# Altium schematic sheet Clock.SchDoc
size 420 x 297 mm; SheetNumber: 2; SheetTotal: 2
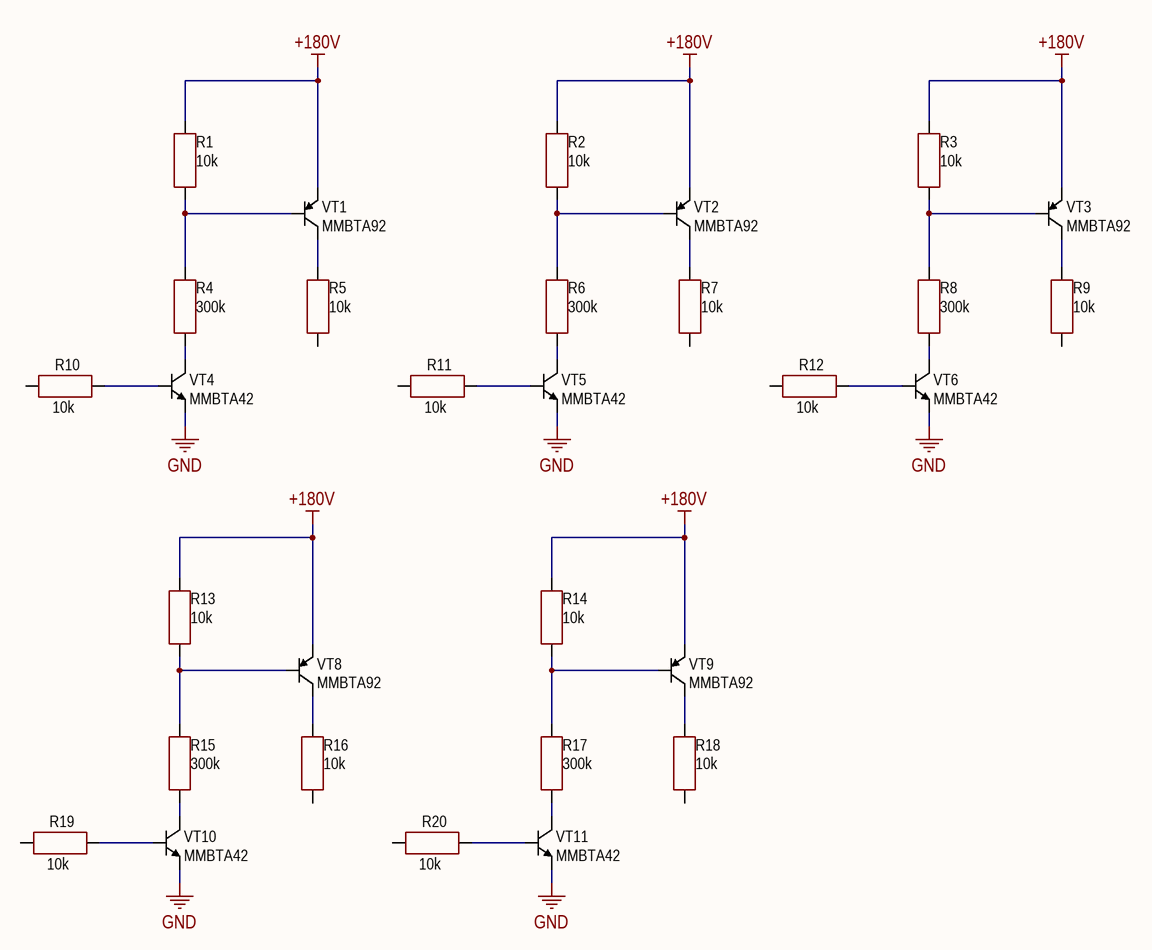
[diagram p0: Clock.SchDoc]

## Parts
R1  value 10k  [RES: 0805]
R2  value 10k  [RES: 0805]
R3  value 10k  [RES: 0805]
R4  value 300k  [RES: 0805]
R5  value 10k  [RES: 0805]
R6  value 300k  [RES: 0805]
R7  value 10k  [RES: 0805]
R8  value 300k  [RES: 0805]
R9  value 10k  [RES: 0805]
R10  value 10k  [RES: 0805]
R11  value 10k  [RES: 0805]
R12  value 10k  [RES: 0805]
R13  value 10k  [RES: 0805]
R14  value 10k  [RES: 0805]
R15  value 300k  [RES: 0805]
R16  value 10k  [RES: 0805]
R17  value 300k  [RES: 0805]
R18  value 10k  [RES: 0805]
R19  value 10k  [RES: 0805]
R20  value 10k  [RES: 0805]
VT1  PartNumber: MMBTA92  [SOT23]
VT2  PartNumber: MMBTA92  [SOT23]
VT3  PartNumber: MMBTA92  [SOT23]
VT4  PartNumber: MMBTA42  [SOT23]
VT5  PartNumber: MMBTA42  [SOT23]
VT6  PartNumber: MMBTA42  [SOT23]
VT8  PartNumber: MMBTA92  [SOT23]
VT9  PartNumber: MMBTA92  [SOT23]
VT10  PartNumber: MMBTA42  [SOT23]
VT11  PartNumber: MMBTA42  [SOT23]

## Nets
+180V: R1.2 R2.2 R3.2 R13.2 R14.2 VT1.2(E) VT2.2(E) VT3.2(E) VT8.2(E) VT9.2(E)
GND: VT4.2(E) VT5.2(E) VT6.2(E) VT10.2(E) VT11.2(E)
NetR1_1: R1.1 R4.2 VT1.1(B)
NetR2_1: R2.1 R6.2 VT2.1(B)
NetR3_1: R3.1 R8.2 VT3.1(B)
NetR4_1: R4.1 VT4.3(C)
NetR5_2: R5.2 VT1.3(C)
NetR6_1: R6.1 VT5.3(C)
NetR7_2: R7.2 VT2.3(C)
NetR8_1: R8.1 VT6.3(C)
NetR9_2: R9.2 VT3.3(C)
NetR10_2: R10.2 VT4.1(B)
NetR11_2: R11.2 VT5.1(B)
NetR12_2: R12.2 VT6.1(B)
NetR13_1: R13.1 R15.2 VT8.1(B)
NetR14_1: R14.1 R17.2 VT9.1(B)
NetR15_1: R15.1 VT10.3(C)
NetR16_2: R16.2 VT8.3(C)
NetR17_1: R17.1 VT11.3(C)
NetR18_2: R18.2 VT9.3(C)
NetR19_2: R19.2 VT10.1(B)
NetR20_2: R20.2 VT11.1(B)

Not connected (* = marked no-connect by the designer): R5 1; R7 1; R9 1; R10 1; R11 1; R12 1; R16 1; R18 1; R19 1; R20 1

## Notes on the sheet
- Подп. и дата
- Инв. № дубл.
- Взам. инв. №
- Инв. № подл.
- Изм.
- Лист
- № докум.
- Подп.
- Дата
- Форма 2а ГОСТ 2.104-2006
- Копировал
- Формат А3

## Library data of the parts
R1-R3 R5 R7 R9-R14 R16 R18-R20 = Resistor_0805: Manufacturer: Yageo; PartNumber: RC0805JR-07100RL; ValueManufacturerPartNumber: Resistor film, 10k, ±5%, 0805, 0.125W, -55...+125°C; TypeResistor: Resistor film; Power: 0.125W; Tolerance: ±5%; Package: 0805; HelpURL: https://www.digikey.com/product-detail/en/yageo/RC0805JR-07100RL/311-100ARCT-ND/731185; Temperature: -55...+125°C
R4 R6 R8 R15 R17 = Resistor_0805: Manufacturer: Yageo; PartNumber: RC0805JR-07100RL; ValueManufacturerPartNumber: Resistor film, 300k, ±5%, 0805, 0.125W, -55...+125°C; TypeResistor: Resistor film; Power: 0.125W; Tolerance: ±5%; Package: 0805; HelpURL: https://www.digikey.com/product-detail/en/yageo/RC0805JR-07100RL/311-100ARCT-ND/731185; Temperature: -55...+125°C
VT1-VT3 VT8 VT9 = BJT_PNP_123: Manufacturer: ON Semiconductor; ValueManufacturerPartNumber: PNP transistor, 45V, 100mA, 100MHz, 300mW, 0.65V, 220, SOT-23, -55...+125°C; TypeTransistor: PNP transistor; VoltageCE: 45V; CurrentCE: 100mA; VoltageSaturation: 0.65V; Frequency: 100MHz; CurrentGain: 220; MaxPower: 300mW; Package: SOT-23; HelpURL: https://www.digikey.com/product-detail/en/on-semiconductor/BC857BLT3G/BC857BLT3GOSCT-ND/2704963; Temperature: -55...+125°C
VT4-VT6 VT10 VT11 = BJT_NPN_132: Manufacturer: ON Semiconductor; ValueManufacturerPartNumber: NPN transistor, 45V, 100mA, 100MHz, 300mW, 0.6V, 420, SOT-23, -55...+125°C; TypeTransistor: NPN transistor; VoltageCE: 45V; CurrentCE: 100mA; VoltageSaturation: 0.6V; Frequency: 100MHz; CurrentGain: 420; MaxPower: 300mW; Package: SOT-23; HelpURL: https://www.digikey.com/product-detail/en/on-semiconductor/BC847CLT1G/BC847CLT1GOSCT-ND/917836; Temperature: -55...+125°C